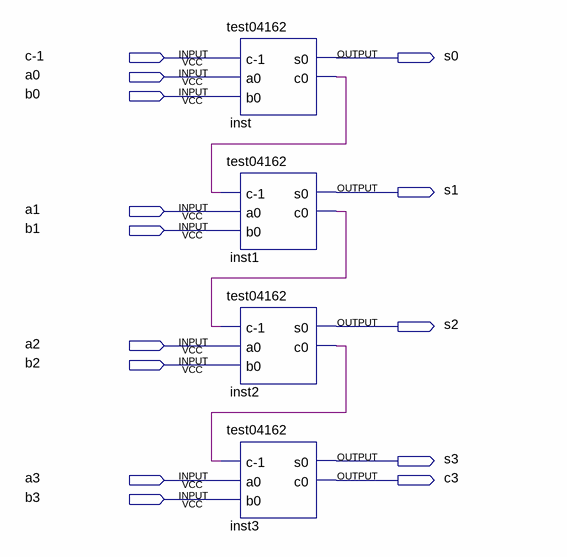
[diagram p0: schematic sheet]
// Quartus schematic Block2.bdf as structural Verilog: 4 symbols, 14 pins
module Block2 (
  input  \c-1 ,
  input  a0,
  input  b0,
  input  a1,
  input  b1,
  input  a2,
  input  b2,
  input  a3,
  input  b3,
  output s0,
  output s1,
  output s2,
  output s3,
  output c3
);

  wire inst1_c0, inst2_c0, inst_c0;

  test04162 inst (.\c-1 (\c-1 ), .a0(a0), .b0(b0), .s0(s0), .c0(inst_c0));
  test04162 inst1 (.\c-1 (inst_c0), .a0(a1), .b0(b1), .s0(s1), .c0(inst1_c0));
  test04162 inst2 (.\c-1 (inst1_c0), .a0(a2), .b0(b2), .s0(s2), .c0(inst2_c0));
  test04162 inst3 (.\c-1 (inst2_c0), .a0(a3), .b0(b3), .s0(s3), .c0(c3));
endmodule
